# Altium schematic sheet Ethernet_Phy.SchDoc
size A
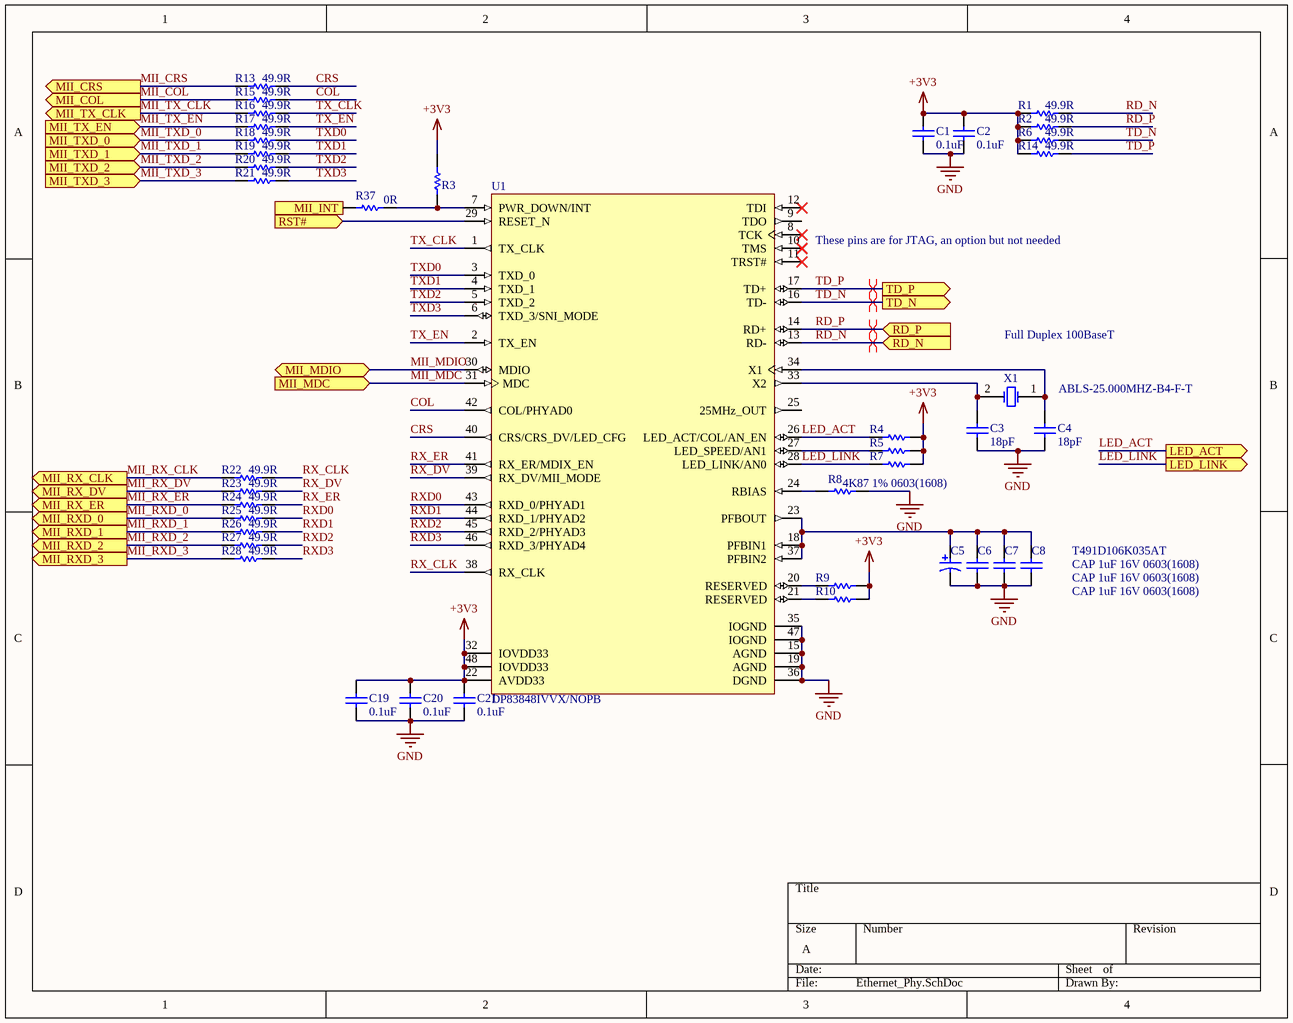
[diagram p0: Ethernet_Phy.SchDoc]

## Parts
C1  0.1uF  [CAPC0603(1608)100_L]
C2  0.1uF  [CAPC0603(1608)100_L]
C3  18pF  [CAPC0603(1608)100_L]
C4  18pF  [CAPC0603(1608)100_L]
C5  T491D106K035AT  [KEMT-T491-D_L]
C6  CAP 1uF 16V 0603(1608)  [CAPC0603(1608)100_N]
C7  CAP 1uF 16V 0603(1608)  [CAPC0603(1608)100_N]
C8  CAP 1uF 16V 0603(1608)  [CAPC0603(1608)100_N]
C19  0.1uF  [CAPC0603(1608)100_L]
C20  0.1uF  [CAPC0603(1608)100_L]
C21  0.1uF  [CAPC0603(1608)100_L]
R1  49.9R  [RESC0603(1608)_L]
R2  49.9R  [RESC0603(1608)_L]
R3  RC0603JR-072K2L  [RESC1608X55X25LL10T15]  (value not drawn)
R4  RC0603JR-072K2L  [RESC1608X55X25LL10T15]  (value not drawn)
R5  RC0603JR-072K2L  [RESC1608X55X25LL10T15]  (value not drawn)
R6  49.9R  [RESC0603(1608)_L]
R7  RC0603JR-072K2L  [RESC1608X55X25LL10T15]  (value not drawn)
R8  4K87 1% 0603(1608)  [RESC0603(1608)_N]
R9  RC0603JR-072K2L  [RESC1608X55X25LL10T15]  (value not drawn)
R10  RC0603JR-072K2L  [RESC1608X55X25LL10T15]  (value not drawn)
R13  49.9R  [RESC0603(1608)_L]
R14  49.9R  [RESC0603(1608)_L]
R15  49.9R  [RESC0603(1608)_L]
R16  49.9R  [RESC0603(1608)_L]
R17  49.9R  [RESC0603(1608)_L]
R18  49.9R  [RESC0603(1608)_L]
R19  49.9R  [RESC0603(1608)_L]
R20  49.9R  [RESC0603(1608)_L]
R21  49.9R  [RESC0603(1608)_L]
R22  49.9R  [RESC0603(1608)_L]
R23  49.9R  [RESC0603(1608)_L]
R24  49.9R  [RESC0603(1608)_L]
R25  49.9R  [RESC0603(1608)_L]
R26  49.9R  [RESC0603(1608)_L]
R27  49.9R  [RESC0603(1608)_L]
R28  49.9R  [RESC0603(1608)_L]
R37  value 0R  [RESC0805(2012)_L]  (hidden comment: RES0805)
U1  DP83848IVVX/NOPB  [PT0048A_L]
X1  ABLS-25.000MHZ-B4-F-T  [ABRA-ABLS2-2_V]

## Ports
LED_ACT (out), LED_LINK (out), MII_COL (out), MII_CRS (out), MII_INT (out), MII_MDC (in), MII_MDIO (bidir), MII_RX_CLK (out), MII_RX_DV (out), MII_RX_ER (out), MII_RXD_0 (out), MII_RXD_1 (out), MII_RXD_2 (out), MII_RXD_3 (out), MII_TX_CLK (out), MII_TX_EN (in), MII_TXD_0 (in), MII_TXD_1 (in), MII_TXD_2 (in), MII_TXD_3 (in), RD_N (in), RD_P (in), RST# (in), TD_N (out), TD_P (out)

## Nets
+3V3: C1.2 C2.2 C19.2 C20.2 C21.2 R1.1 R2.1 R3.2 R4.2 R5.2 R6.1 R7.2 R9.2 R10.2 R14.1 U1.22(AVDD33) U1.32(IOVDD33) U1.48(IOVDD33)
GND: C1.1 C2.1 C3.1 C4.1 C5.2 C6.1 C7.1 C8.1 C19.1 C20.1 C21.1 R8.2 U1.15(AGND) U1.19(AGND) U1.35(IOGND) U1.36(DGND) U1.47(IOGND)
COL: R15.2 U1.42(COL/PHYAD0)
CRS: R13.2 U1.40(CRS/CRS_DV/LED_CFG)
LED_ACT: R4.1 U1.26(LED_ACT/COL/AN_EN) ; port LED_ACT
LED_LINK: R7.1 U1.28(LED_LINK/AN0) ; port LED_LINK
MII_COL: R15.1 ; port MII_COL
MII_CRS: R13.1 ; port MII_CRS
MII_INT: R37.1 ; port MII_INT
MII_MDC: U1.31(MDC) ; port MII_MDC
MII_MDIO: U1.30(MDIO) ; port MII_MDIO
MII_RX_CLK: R22.1 ; port MII_RX_CLK
MII_RX_DV: R23.1 ; port MII_RX_DV
MII_RX_ER: R24.1 ; port MII_RX_ER
MII_RXD_0: R25.1 ; port MII_RXD_0
MII_RXD_1: R26.1 ; port MII_RXD_1
MII_RXD_2: R27.1 ; port MII_RXD_2
MII_RXD_3: R28.1 ; port MII_RXD_3
MII_TX_CLK: R16.1 ; port MII_TX_CLK
MII_TX_EN: R17.1 ; port MII_TX_EN
MII_TXD_0: R18.1 ; port MII_TXD_0
MII_TXD_1: R19.1 ; port MII_TXD_1
MII_TXD_2: R20.1 ; port MII_TXD_2
MII_TXD_3: R21.1 ; port MII_TXD_3
RD_N: R1.2 U1.13(RD-) ; port RD_N
RD_P: R2.2 U1.14(RD+) ; port RD_P
RST#: U1.29(RESET_N) ; port RST#
RX_CLK: R22.2 U1.38(RX_CLK)
RX_DV: R23.2 U1.39(RX_DV/MII_MODE)
RX_ER: R24.2 U1.41(RX_ER/MDIX_EN)
RXD0: R25.2 U1.43(RXD_0/PHYAD1)
RXD1: R26.2 U1.44(RXD_1/PHYAD2)
RXD2: R27.2 U1.45(RXD_2/PHYAD3)
RXD3: R28.2 U1.46(RXD_3/PHYAD4)
TD_N: R6.2 U1.16(TD-) ; port TD_N
TD_P: R14.2 U1.17(TD+) ; port TD_P
TX_CLK: R16.2 U1.1(TX_CLK)
TX_EN: R17.2 U1.2(TX_EN)
TXD0: R18.2 U1.3(TXD_0)
TXD1: R19.2 U1.4(TXD_1)
TXD2: R20.2 U1.5(TXD_2)
TXD3: R21.2 U1.6(TXD_3/SNI_MODE)
NetC3_2: C3.2 U1.33(X2) X1.2(X2)
NetC4_2: C4.2 U1.34(X1) X1.1(X1)
NetC5_1: C5.1 C6.2 C7.2 C8.2 U1.18(PFBIN1) U1.23(PFBOUT) U1.37(PFBIN2)
NetR3_1: R3.1 R37.2 U1.7(PWR_DOWN/INT)
NetR5_1: R5.1 U1.27(LED_SPEED/AN1)
NetR8_1: R8.1 U1.24(RBIAS)
NetR9_1: R9.1 U1.20(RESERVED)
NetR10_1: R10.1 U1.21(RESERVED)

Not connected (* = marked no-connect by the designer): U1 8(TCK)* 9(TDO) 10(TMS)* 11(TRST#)* 12(TDI)* 25(25MHz_OUT)

## Layout directives
differential pair; differential pair class RX Diff: RD_N, RD_P
differential pair; differential pair class TX_DIFF: TD_N, TD_P

## Notes on the sheet
- (near U1) These pins are for JTAG, an option but not needed
- Full Duplex 100BaseT

## Library data of the parts
C1-C4 C19-C21 = CMP-1590-00005-1: 0603 (1608 Metric) Chip Capacitor; Case-Metric: 1608; Case-EIA: 0603; PackageReference: CAPC0603(1608)100
C5 = CMP-2000-07580-1: Tantalum Capacitor, 10 uF, +/- 10%, 35 V, -55 to 125 degC, 2-Pin SMD, RoHS, Tape and Reel; Manufacturer: Kemet; Capacitance: 10uF; Leakage Current: 3.5uA; Dissipation Factor: 6%; Case\/Package: 2917; Polarity: Polar; Voltage Rating: 35V; ESR (Equivalent Series Resistance): 1Ohm; Life (Hours): 2000Hour; Tolerance: 20%; Max Operating Temperature: 125degC; Length: 7.3mm; Depth: 4.3mm; Termination: SMD/SMT; Case Code (Metric): 7343; Number of Pins: 2; Package Reference: T491-D; Width: 4.3mm; RoHSCompliant: True; Lead Free: LeadFree; Radiation Hardening: No; Height: 2.8mm; Voltage Rating (DC): 35V; REACH SVHC: NoSVHC; Datasheet URL: http://www.kemet.com/Lists/ProductCatalog/Attachments/254/KEM_T2005_T491.pdf; Datasheet Version: 07/2017; Manufacturer URL: http://www.kemet.com/; Mounting Technology: SurfaceMount; Min Operating Temperature: -55degC; Case Code (Imperial): 2917; Package Quantity: 1; Packaging: TapeandReel; Package Description: 2-Pin Surface Mount Device, Body 7.3 x 4.3 mm; Height - Seated (Max): 0.122inch; Voltage: 35V; Dielectric Material: Tantalum; Mount: PCB
C6-C8 = CMP-1035-02736-1: CAP 1uF 16V ±5% 0603 (1608 Metric) Thickness 1mm SMD; Case-Metric: 1608; Case-EIA: 0603; Tolerance: Â±5%; Technology: SMT; Max Thickness: 1 mm; Rated Voltage: 16 V; Value: 1uF
R1 R2 R6 R13-R28 = CMP-1591-00001-1: 0603 (1608 Metric) Chip Resistor; Case-Metric: 1608; Case-EIA: 0603; Value: 49.9R; PackageReference: RESC0603(1608)
R3-R5 R7 R9 R10 = CMP-2000-06957-1: Chip Resistor, 2.2 KOhm, +/- 5%, 0.1 W, -55 to 155 degC, 0603 (1608 Metric), RoHS, Tape and Reel; Manufacturer: Yageo; Resistance: 2.2kOhms; Temperature Coefficient: 100PPM/C; Voltage Rating: 50V; Power Rating: 100mW; Product: ThickFilmResistorsGeneralPurpose; Manufacturer URL: http://www.yageo.com/; Datasheet URL: http://www.yageo.com/documents/recent/PYu-RC_Group_51_RoHS_L_7.pdf; Package Description: 2-Pin Surface Mount Device, Body 1.6 x 0.8 mm; Mounting Technology: SurfaceMount; Case Code - mm: 1608; Case Code - in: 0603; Packaging: Reel; Operating Temperature Range: -55Cto+155C; Series: RC; Termination Style: SMD/SMT; Package Reference: 0603; Datasheet Version: Rev. 7, 05/2017; Tolerance: 5%
R8 = CMP-1012-00588-1: 4K87 0.1W 1% 0603 (1608 Metric)  SMD; Case-EIA: 0603; Case-Metric: 1608; Value: 4870.00 Ohm; Power: 0.1 W; Technology: SMT; Tolerance: 1 %
R37 = CMP-1591-00002-1: 0805 (2012 Metric) Chip Resistor; Case-EIA: 0805; Case-Metric: 2012; PackageReference: RESC0805(2012)
U1 = CMP-0058-01357-3: PHYTER® Industrial Temperature Single Port 10/100 Mb/s Ethernet Physical Layer Transceiver, 48-pin LQFP, Pb-Free, 1000 Reel; Manufacturer: Texas Instruments; CompType: Interface IC; PackageTopMarking: NSUZXYTT*DP83848VV*VBI; PowerWise: N; High-Reliability: Y; PackageDescription: LQFP, 7 x 7 x 1.4mm, 48 Lead, 0.5mm Pitch; ComponentLink1Description: Datasheet URL; PackageReference: PT0048A; PartNumber: DP83848IVVX/NOPB; ComponentLink1URL: http://www.ti.com/general/docs/lit/getliterature.tsp?genericPartNumber=DP83848I&fileType=pdf; PinCount: 48; RoHS: Y
X1 = CMP-0277-00002-1: Low Profile Surface Mount Microprocessor Crystal, 25 MHz +/-30 ppm, 180 Ohm, -40 to 85 degC, 2-Pin 11.4 x 4.7 x 3.3 mm SMD, RoHS, Tape and Reel; Manufacturer: Abracon; PartNumber: ABLS2-4.096MHZ-D4Y-T; Operation Mode: Fundamental or 3rd Overtone; Shunt Capacitance: 7 pF Max.; ESR: 180 Ohm; Load Capacitance: 18 pF; Frequency: 4.096 MHz; Mounting Technology: Surface Mount; PackageDescription: 2-Pin SMD, Body 11.4 x 4.7 mm, Height 3.3 mm; ComponentLink1URL: http://www.abracon.com/; Freq. Stability: +/- 30 ppm; ComponentLink2Description: Datasheet; Operating Temp. Range: -40 to 85 degC; Packing: Tape and Reel; RoHS: TRUE; PackageReference: ABLS2-2; DatasheetVersion: Rev. 03.31.11; Freq. Tolerance: +/- 30 ppm; ComponentLink2URL: http://www.abracon.com/Resonators/ABLS2.pdf; ComponentLink1Description: Manufacturer URL